# Altium schematic sheet STM32_Controller.SchDoc: =DocumentName
size 393 x 281 mm; Date: Do not fill; ApprovedBy: Do not fill; CheckedBy: Do not fill; CompanyName: STAR; DrawnBy: Do not fill; Engineer: Do not fill; Organization: STAR; Address1: Avenida Peseta 68, 1ºB; Address2: Madrid, Madrid 28054; Address3: +34603739927; Address4: contact.star@uc3m.es; DocumentNumber: Do not fill; SheetNumber: 3; SheetTotal: 4; Project Name: Purple Pill; Sheet Name: STM32 Controller; Time: Do not fill; ImagePath: Do not fill; Application_BuildNumber: Do not fill
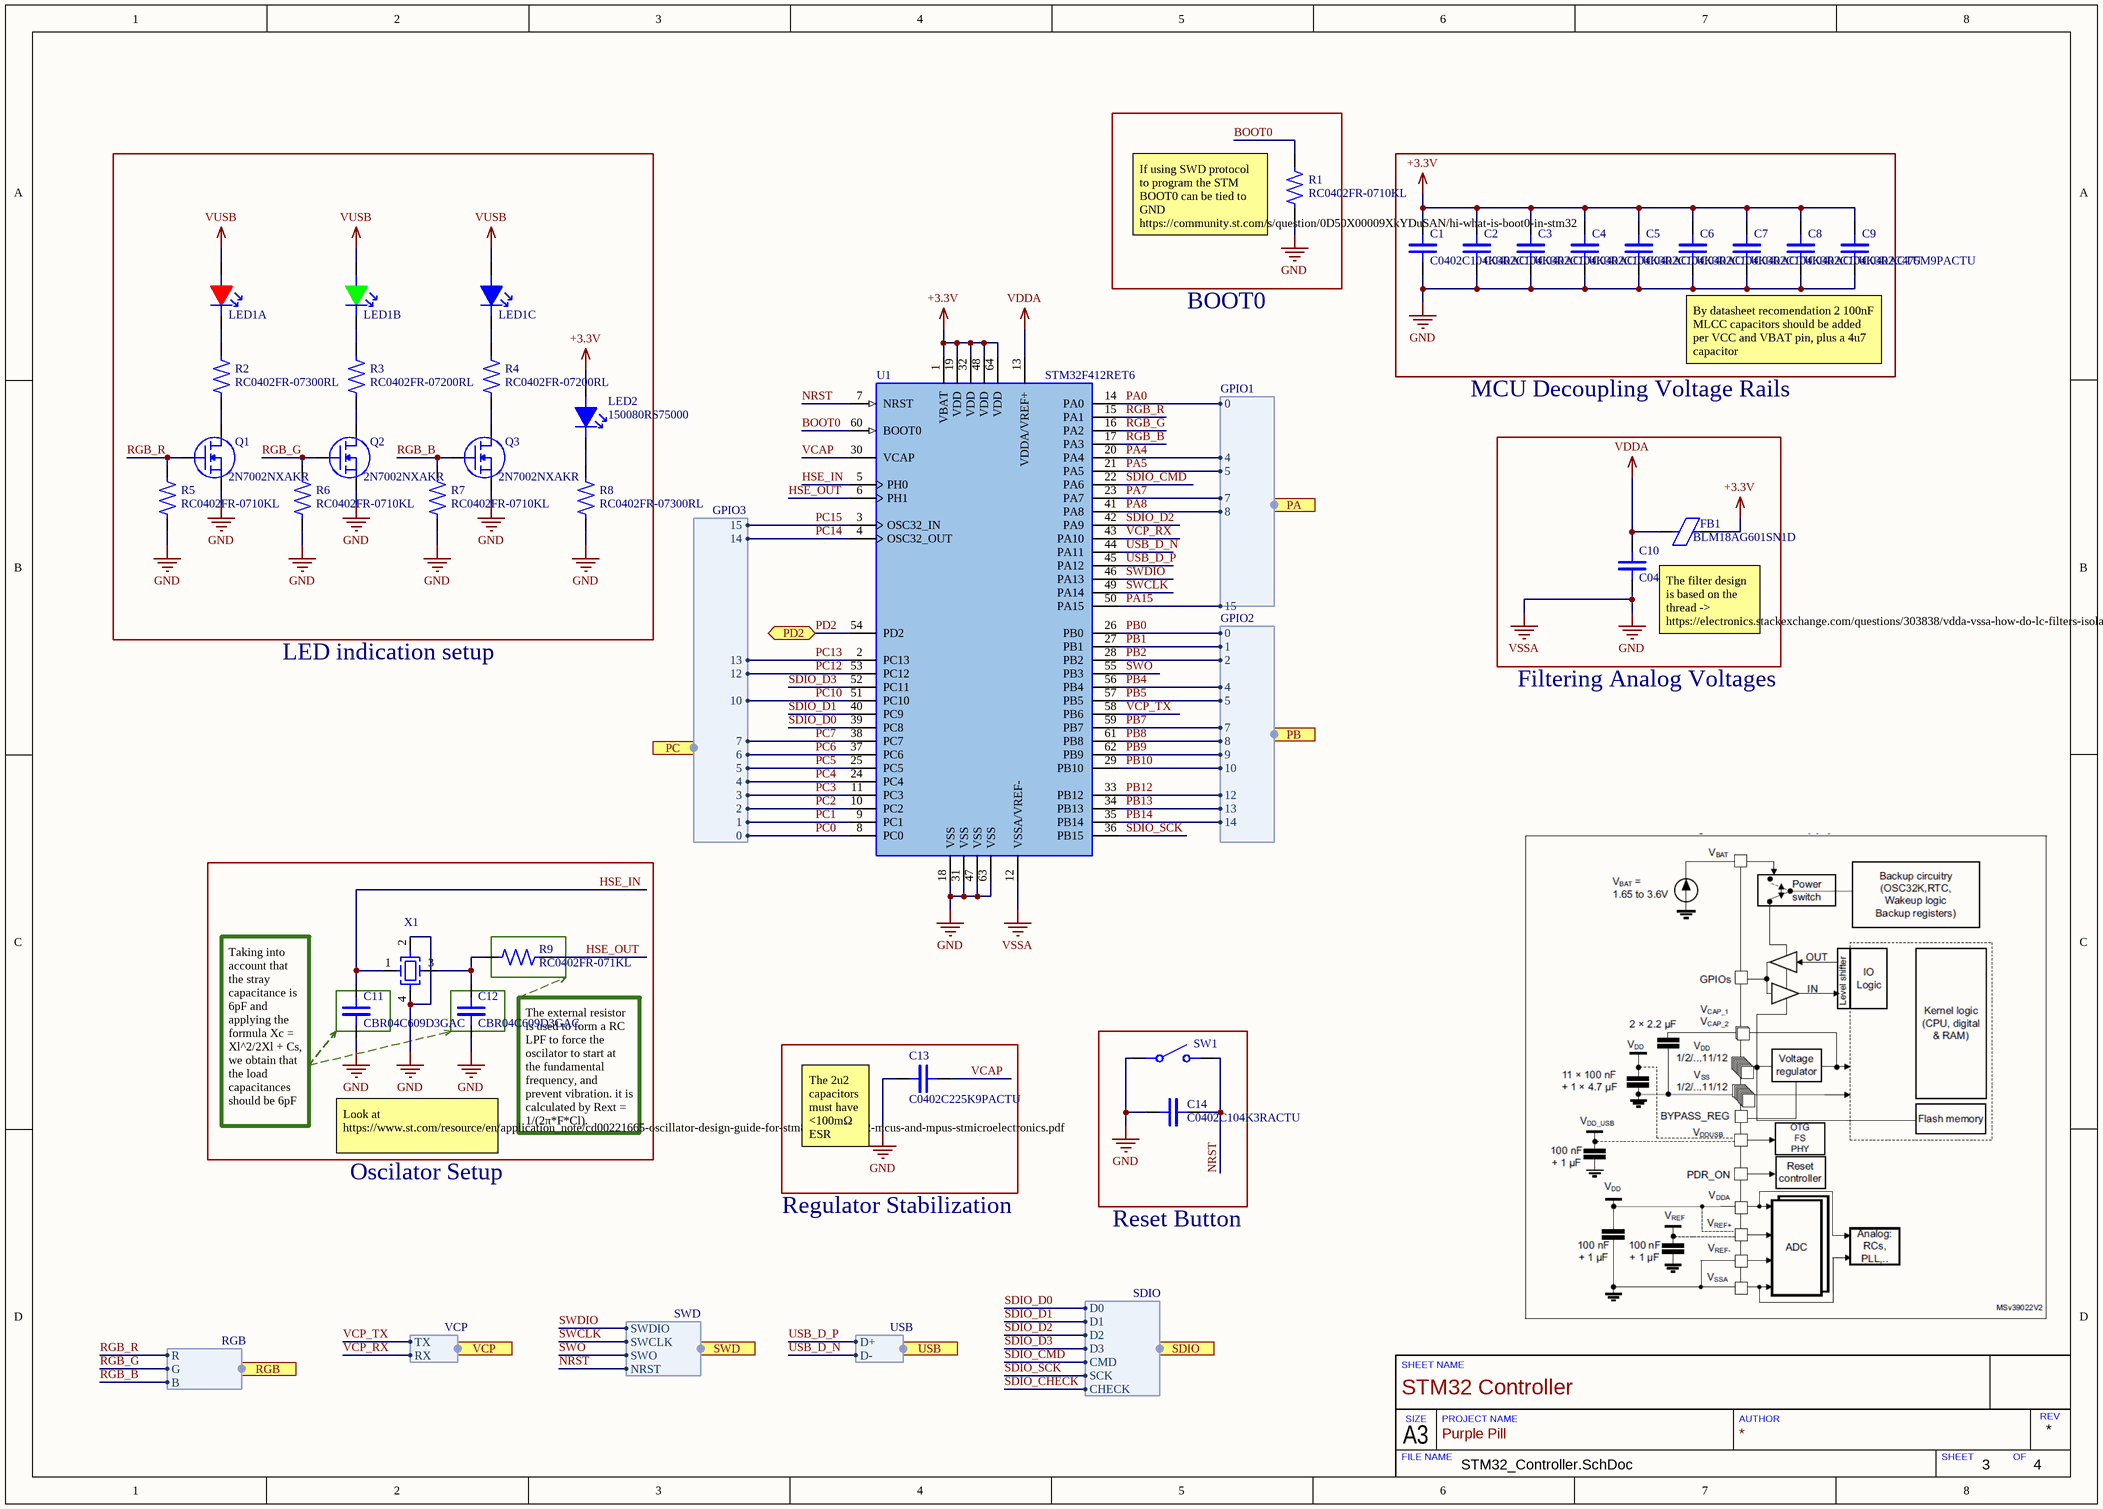
[diagram p0: STM32_Controller.SchDoc]

## Parts
C1  C0402C104K3RACTU  [CM0402_KEMET]
C2  C0402C104K3RACTU  [CM0402_KEMET]
C3  C0402C104K3RACTU  [CM0402_KEMET]
C4  C0402C104K3RACTU  [CM0402_KEMET]
C5  C0402C104K3RACTU  [CM0402_KEMET]
C6  C0402C104K3RACTU  [CM0402_KEMET]
C7  C0402C104K3RACTU  [CM0402_KEMET]
C8  C0402C104K3RACTU  [CM0402_KEMET]
C9  C0402C475M9PACTU  [CM0402_KEMET]
C10  C0402C104K3RACTU  [CM0402_KEMET]
C11  CBR04C609D3GAC  [CM0402_KEMET]
C12  CBR04C609D3GAC  [CM0402_KEMET]
C13  C0402C225K9PACTU  [CM0402_KEMET]
C14  C0402C104K3RACTU  [CM0402_KEMET]
FB1  BLM18AG601SN1D  [FB0603_MURATA]
LED1  TC5050RGBF08-3CJH-AF53A  [LED_RGB_5050]  (value not drawn)  (parts A,B,C of 3)
LED2  150080RS75000  [LED0805_WURTH]
Q1  2N7002NXAKR  [SOT23-3]
Q2  2N7002NXAKR  [SOT23-3]
Q3  2N7002NXAKR  [SOT23-3]
R1  RC0402FR-0710KL  [R0402_YAGEO]
R2  RC0402FR-07300RL  [R0402_YAGEO]
R3  RC0402FR-07200RL  [R0402_YAGEO]
R4  RC0402FR-07200RL  [R0402_YAGEO]
R5  RC0402FR-0710KL  [R0402_YAGEO]
R6  RC0402FR-0710KL  [R0402_YAGEO]
R7  RC0402FR-0710KL  [R0402_YAGEO]
R8  RC0402FR-07300RL  [R0402_YAGEO]
R9  RC0402FR-071KL  [R0402_YAGEO]
SW1  Push button SPST small  [1TS002E-2400-2500-CT]  (value not drawn)
U1  STM32F412RET6  [LQFP64]
X1  CR24MHz  [XTAL_3.2x2.4]  (value not drawn)

## Ports
PA (harness GPIO1), PB (harness GPIO2), PC (harness GPIO3), PD2 (bidir), RGB (harness RGB), SDIO (harness SDIO), SWD (harness SWD), USB (harness USB), VCP (harness VCP)

## Harnesses
GPIO2: 0, 5, 7, 8, 10, 12, 1, 13, 14, 2, 9, 4
GPIO1: 4, 8, 15, 5, 7, 0
GPIO3: 10, 7, 6, 5, 4, 3, 1, 0, 2, 12, 13, 15, 14
SWD: SWDIO, SWCLK, SWO, NRST
VCP: TX, RX
USB: D+, D-
SDIO: D3, CMD, SCK, CHECK, D2, D1, D0
RGB: R, G, B

## Nets
+3.3V: C1.2 C2.2 C3.2 C4.2 C5.2 C6.2 C7.2 C8.2 C9.2 FB1.2 LED2.2(Anode) U1.1(VBAT) U1.19(VDD) U1.32(VDD) U1.48(VDD) U1.64(VDD)
GND: C1.1 C2.1 C3.1 C4.1 C5.1 C6.1 C7.1 C8.1 C9.1 C10.1 C11.1 C12.1 C13.2 C14.1 Q1.3(Source) Q2.3(Source) Q3.3(Source) R1.1 R5.1 R6.1 R7.1 R8.1 SW1.2 U1.12(VSSA/VREF-) U1.18(VSS) U1.31(VSS) U1.47(VSS) U1.63(VSS) X1.2(Ground) X1.4(Ground)  [also labelled VSSA]
VDDA: C10.2 FB1.1 U1.13(VDDA/VREF+)
VUSB: LED1.1(Anode1) LED1.3(Anode2) LED1.5(Anode3)
BOOT0: R1.2 U1.60(BOOT0)
HSE_IN: C11.2 U1.5(PH0) X1.1(XTAL1)
HSE_OUT: R9.2 U1.6(PH1)
NRST: C14.2 SW1.1 U1.7(NRST) ; port SWD.NRST
PA0: U1.14(PA0) ; port PA.0
PA4: U1.20(PA4) ; port PA.4
PA5: U1.21(PA5) ; port PA.5
PA7: U1.23(PA7) ; port PA.7
PA8: U1.41(PA8) ; port PA.8
PA15: U1.50(PA15) ; port PA.15
PB0: U1.26(PB0) ; port PB.0
PB1: U1.27(PB1) ; port PB.1
PB2: U1.28(PB2) ; port PB.2
PB4: U1.56(PB4) ; port PB.4
PB5: U1.57(PB5) ; port PB.5
PB7: U1.59(PB7) ; port PB.7
PB8: U1.61(PB8) ; port PB.8
PB9: U1.62(PB9) ; port PB.9
PB10: U1.29(PB10) ; port PB.10
PB12: U1.33(PB12) ; port PB.12
PB13: U1.34(PB13) ; port PB.13
PB14: U1.35(PB14) ; port PB.14
PC0: U1.8(PC0) ; port PC.0
PC1: U1.9(PC1) ; port PC.1
PC2: U1.10(PC2) ; port PC.2
PC3: U1.11(PC3) ; port PC.3
PC4: U1.24(PC4) ; port PC.4
PC5: U1.25(PC5) ; port PC.5
PC6: U1.37(PC6) ; port PC.6
PC7: U1.38(PC7) ; port PC.7
PC10: U1.51(PC10) ; port PC.10
PC12: U1.53(PC12) ; port PC.12
PC13: U1.2(PC13) ; port PC.13
PC14: U1.4(OSC32_OUT) ; port PC.14
PC15: U1.3(OSC32_IN) ; port PC.15
PD2: U1.54(PD2) ; port PD2
RGB_B: Q3.1(Gate) R7.2 U1.17(PA3) ; port RGB.B
RGB_G: Q2.1(Gate) R6.2 U1.16(PA2) ; port RGB.G
RGB_R: Q1.1(Gate) R5.2 U1.15(PA1) ; port RGB.R
SDIO_CHECK: port SDIO.CHECK
SDIO_CMD: U1.22(PA6) ; port SDIO.CMD
SDIO_D0: U1.39(PC8) ; port SDIO.D0
SDIO_D1: U1.40(PC9) ; port SDIO.D1
SDIO_D2: U1.42(PA9) ; port SDIO.D2
SDIO_D3: U1.52(PC11) ; port SDIO.D3
SDIO_SCK: U1.36(PB15) ; port SDIO.SCK
SWCLK: U1.49(PA14) ; port SWD.SWCLK
SWDIO: U1.46(PA13) ; port SWD.SWDIO
SWO: U1.55(PB3) ; port SWD.SWO
USB_D_N: U1.44(PA11) ; port USB.D-
USB_D_P: U1.45(PA12) ; port USB.D+
VCAP: C13.1 U1.30(VCAP)
VCP_RX: U1.43(PA10) ; port VCP.RX
VCP_TX: U1.58(PB6) ; port VCP.TX
NetC12_2: C12.2 R9.1 X1.3(XTAL2)
NetLED1_2: LED1.2(Cathode1) R2.2
NetLED1_4: LED1.4(Cathode2) R3.2
NetLED1_6: LED1.6(Cathode3) R4.2
NetLED2_1: LED2.1(Cathode) R8.2
NetQ1_2: Q1.2(Drain) R2.1
NetQ2_2: Q2.2(Drain) R3.1
NetQ3_2: Q3.2(Drain) R4.1

## Notes on the sheet
- (near R1) If using SWD protocol to program the STM BOOT0 can be tied to GND https://community.st.com/s/question/0D50X00009XkYDuSAN/hi-what-is-boot0-in-stm32
- BOOT0
- By datasheet recomendation 2 100nF MLCC capacitors should be added per VCC and VBAT pin, plus a 4u7 capacitor
- MCU Decoupling Voltage Rails
- The filter design is based on the thread -> https://electronics.stackexchange.com/questions/303838/vdda-vssa-how-do-lc-filters-isolate-the-input-pins-to-minimize-error-and-noi
- LED indication setup
- Filtering Analog Voltages
- Taking into account that the stray capacitance is 6pF and applying the formula Xc = Xl^2/2Xl + Cs, we obtain that the load capacitances should be 6pF
- The external resistor is used to form a RC LPF to force the oscilator to start at the fundamental frequency, and prevent vibration. it is calculated by Rext = 1/(2π*F*Cl).
- Look at https://www.st.com/resource/en/application_note/cd00221665-oscillator-design-guide-for-stm8af-al-s-stm32-mcus-and-mpus-stmicroelectronics.pdf
- Oscilator Setup
- (near C13) The 2u2 capacitors must have <100mΩ ESR
- Regulator Stabilization
- Reset Button
- RGB LED analog voltages
- Virtual COM port through ST-LINK
- SWD comunication protocol for debug and program
- USB D+ & D- differential signal
- Secure Digital Input Output, interface for SD cards
- SHEET NAME
- FILE NAME
- A3
- SIZE
- PROJECT NAME
- AUTHOR
- SHEET
- OF
- REV

## Library data of the parts
C1-C8 C10 C14 = CMP-CAP-002-00024-2: 0.1 µF ±10% 25V Ceramic Capacitor X7R 0402 (1005 Metric; Manufacturer: KEMET; Capacitance: 100nF; Unit weight: 1.5mg; Voltage rating: 25V; Component link: https://octopart.com/c0402c104k3ractu-kemet-71105629?r=sp; Height: 500µm; Mounting type: SMT; Maximun operating temperature: 125°C; Package: 0402; RoHS: Yes; Minimun operating temperature: -55°C; Dielectric: X7R; Tolerance: 10%; LCSC Part#: C1525
C9 = CMP-CAP-002-00026-2: 4.7 µF ±20% 6.3V Ceramic Capacitor X5R 0402 (1005 Metric); Manufacturer: KEMET; Unit weight: 1.5mg; Capacitance: 4.7µF; Tolerance: 10%; Dielectric: X5R; Maximun operating temperature: 85°C; Mounting type: SMT; Component link: https://octopart.com/search?q=C0402C475M9PACTU&currency=USD&specs=0; RoHS: Yes; Voltage rating: 6.3V; Height: 500µm; Package: 0402; Minimun operating temperature: -55°C; LCSC Part#: C368809
C11 C12 = CMP-CAP-002-00027-2: 6 pF ±0.5pF 25V Ceramic Capacitor C0G, NP0 0402 (1005 Metric); Manufacturer: KEMET; Unit weight: 1.5mg; Tolerance: 8.3%; Capacitance: 6pF; RoHS: Yes; Mounting type: SMT; Height: 500µm; Maximun operating temperature: 125°C; Voltage rating: 25V; Component link: https://octopart.com/cbr04c609d3gac-kemet-88381094?r=sp; Package: 0402; Dielectric: C0G; Minimun operating temperature: -55°C; LCSC Part#: C1575
C13 = CMP-CAP-002-00025-2: 2.2 µF ±10% 6.3V Ceramic Capacitor X5R 0402 (1005 Metric); Manufacturer: KEMET; Unit weight: 1.5mg; Capacitance: 2.2µF; Height: 500µm; Voltage rating: 6.3V; Mounting type: SMT; Component link: https://octopart.com/c0402c225k9pactu-kemet-46923142?r=sp; Minimun operating temperature: -55°C; RoHS: Yes; Tolerance: 10%; Maximun operating temperature: 125°C; Dielectric: X5R; Package: 0402; LCSC Part#: C77002
FB1 = CMP-IND-001-00000-2: Ferrite Chip, 1 Function(s), 0.5A, 2 Pin(s); Manufacturer: Murata; Maximun DC resistance: 0.38; Impedance: 600; Unit weight: 35mg; Test frequency: 100MHz; Tolerance: 25%; Maximun DC current: 500mA; RoHs: Yes; Height: 800µm; Maximun operating temperature: 125°C; Component link: https://octopart.com/blm18ag601sn1d-murata-42207?r=sp#PriceAndStock; Package: 0603; Mounting type: SMT; Minimun operating temperature: -55°C; LCSC Part#: C19330
LED1 = CMP-DIOD-001-00006-3: 20mA -40℃~+85℃ RGB 200mW 5050(mm) Light Emitting Diodes (LED) ROHS; pin to pad: 1>2 2>5 3>1 4>6 5>3 6>4; Manufacturer: TCWIN; Forward Voltages: R: 2.2V, G: 3V, B: 3V; Lens transparency: Silicone; MCD ratings: R: 700mcd, G: 1750mcd, B: 500mcd; Viewing angle: 60º; Colors/Wavelegths: R: 622, G: 517, B: 467; Nominal Currents: R: 20mA, G: ~20mA, B: ~20mA; Component link: https://octopart.com/tc5050rgbf08-3cjh-af53a-tcwin-122695383?r=sp; RoHS: Yes; Mounting type: SMT; Maximun operating temperature: 85°C; Package: 5050 (mm); Height: 1.6mm; Minimun operating temperature: -40°C; LCSC Part#: C784540
LED2 = CMP-DIOD-001-00002-3: Red 625nm LED Indication - Discrete 2V 0805 (2012 Metric); Manufacturer: Würth Elektronik; Unit weight: 25mg; Lens transparency: Clear; Viewing angle: 140º; MCD ratings: 150mcd; Nominal Currents: 20mA; Colors/Wavelegths: Red, 625nm; Minimun operating temperature: -40°C; Maximun operating temperature: 85°C; Forward Voltages: 2V; Mounting type: SMT; RoHS: Yes; Package: 0805; Height: 800µm; Component link: https://octopart.com/150080rs75000-w%C3%BCrth+elektronik-29717781?r=sp; LCSC Part#: C5137314
Q1-Q3 = CMP-TRAN-002-00009-3: 2N7002NXAK - 60 V, single N-channel Trench MOSFET; pin to pad: 2>3 3>2; Manufacturer: Nexperia; VoltageGS (th): 1.6V; V (DS) breakdown: 60V; gfs: 500m; Unit weight: 8mg; Channel Type: N; Rds (ON): 3; Power Dissipation: 325mW; I (d) Pulsed: 760mA; I (GS) leakage: 500nA; I (D) Continuous: 190mA; RoHs: Yes; Component link: https://octopart.com/2n7002nxakr-nexperia-103147780?r=sp; Mounting type: SMT; Minimun operating temperature: -55°C; Package: SOT23-3; Maximun operating temperature: 150°C; Height: 1.1mm; LCSC Part#: C350313
R1 R5-R7 = CMP-RES-000-00048-4: 10 kOhms ±1% 0.063W, 1/16W Chip Resistor 0402 (1005 Metric) Moisture Resistant Thick Film; Manufacturer: YAGEO; Temperature coefficient: 100PPM/Cº; Voltage rating: 50V; Resistance: 10k; Unit weight: 650µg; Power rating: 62.5mW; Mounting type: SMT; Maximun operating temperature: 155°C; Component link: https://octopart.com/rc0402fr-0710kl-yageo-55458461?r=sp; Tolerance: 1%; Minimun operating temperature: -55°C; Package: 0402; RoHS: Yes; Height: 350µm; LCSC Part#: C60490
R2 R8 = CMP-RES-000-00051-3: 300 Ohms ±1% 0.063W, 1/16W Chip Resistor 0402 (1005 Metric) Moisture Resistant Thick Film; Manufacturer: YAGEO; Power rating: 62.5mW; Temperature coefficient: 100; Resistance: 300; Voltage rating: 50V; Unit weight: 650µg; Component link: https://octopart.com/rc0402fr-07300rl-yageo-39798431?r=sp; Mounting type: SMT; Tolerance: 1%; Package: 0402; RoHS: Yes; Maximun operating temperature: 155°C; Minimun operating temperature: -55°C; Height: 350µm; LCSC Part#: C138010
R3 R4 = CMP-RES-000-00050-3: 200 Ohms ±1% 0.063W, 1/16W Chip Resistor 0402 (1005 Metric) Moisture Resistant Thick Film; Manufacturer: YAGEO; Voltage rating: 50V; Unit weight: 650µg; Resistance: 200; Temperature coefficient: 100; Power rating: 62.5mW; Mounting type: SMT; Minimun operating temperature: -55°C; Height: 350µm; Tolerance: 1%; Package: 0402; Maximun operating temperature: 155°C; RoHS: Yes; Component link: https://octopart.com/rc0402fr-07200rl-yageo-42471199?r=sp; LCSC Part#: C114764
R9 = CMP-RES-000-00053-2: 1 kOhms ±1% 0.063W, 1/16W Chip Resistor 0402 (1005 Metric) Moisture Resistant Thick Film; Manufacturer: YAGEO; Power rating: 62.5mW; Temperature coefficient: 100; Voltage rating: 50V; Resistance: 1k; Unit weight: 650µg; Maximun operating temperature: 155°C; Tolerance: 1%; Mounting type: SMT; Package: 0402; Minimun operating temperature: -55°C; Component link: https://octopart.com/rc0402fr-071kl-yageo-55402862?r=sp; RoHS: Yes; Height: 350µm; LCSC Part#: C106235
SW1 = CMP-SWI-000-00001-3: No NO Gull Wing 0.6W 50mA 6.1mm 100MΩ 30000 240gf@±50gf 12V -40℃~+90℃ 3.7mm 2.5mm Red Rectangle button Brick nogging SPST SMD,6.1x3.7x2.5mm Tactile Switches ROHS; Manufacturer: HYP; Equivalent resistance: 0.1; Package: 6.1mm x 3.7mm; Height: 2.5mm; RoHS: Yes; Maximun operating temperature: 90°C; Orientation: Up; Contact material: brass; Minimun operating temperature: -45°C; Steady state: NO; Throw configuration: SPST; Component link: https://octopart.com/1ts002e-2400-2500-ct-hongyuan+precision-99594626?r=sp; Type: Tactile switch; Mounting type: SMT; Voltage: 12V; LCSC Part#: C319365
U1 = CMP-ICS-003-00004-2: RISC Microcontroller, 32-Bit, FLASH, CORTEX-M4 CPU, 100MHz, CMOS, PQFP64; Manufacturer: STMicroelectronics; Core name/s: ARM -M4; DAC: None; Typical power rating.: 36mW; Minimun supply voltage: 1.7V; Core bit size: 32; RAM size: 256k; Flash/SDRAM size: 512k; Maximun supply voltage: 3.6V; Unit weight: 360mg; ADC: 16x12; I/O pins: 46; I/O voltages: 3.3V; Core count: 1; Interfaces: SPI, I2C, USART, SDIO, USB, CAN; Maximun operating temperature: 125; RoHS: Yes; Height: 1.6mm; Mounting type: SMT; Frequency: 100MHz; Package: LQFP64; Component link: https://octopart.com/stm32f412ret6-stmicroelectronics-75302708; Minimun operating temperature: -40°C; LCSC Part#: C89374
X1 = CMP-003-00032-9: Crystal Oscillator 24MHz 9pF +/-10ppm +/-20ppm; ESR: 40; Drive Level: 200 uW; Brand: ECS; Frequency Stability: 20 PPM; Tolerance: 10 PPM; Width: 2.5 mm; Maximum Operating Temperature: + 105 C; Packaging: Cut Tape; Series: ECS-33B; RoHS: Yes; Product: Crystals; Mounting Style: SMD/SMT; Load Capacitance: 9pF; Type: Miniature Crystal; Termination Style: SMD/SMT; Manufacturer: ECS; Height: 0.8 mm; Package/Case: SMD-4; Frequency: 24MHz; Product Category: Crystals; Length: 3.2 mm; Minimum Operating Temperature: - 40 C; ComponentLink1URL: https://www.mouser.es/datasheet/2/122/ECS_33B-1649459.pdf; ComponentLink1Description: Datasheet; LCSC Part#: C90910